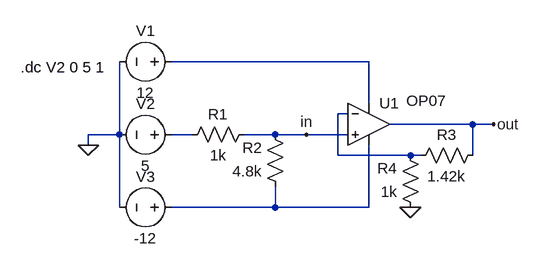
[diagram p0: schematic level_converter.asc]
level_converter.asc, the LTspice schematic file:
Version 4
SHEET 1 880 680
WIRE 224 -112 -80 -112
WIRE 224 -48 224 -112
WIRE 192 -32 176 -32
WIRE 384 -16 256 -16
WIRE 416 -16 384 -16
WIRE -160 0 -160 -112
WIRE -160 0 -208 0
WIRE -48 0 -80 0
WIRE 80 0 32 0
WIRE 128 0 80 0
WIRE 192 0 128 0
WIRE -208 16 -208 0
WIRE 176 32 176 -32
WIRE 288 32 176 32
WIRE 304 32 288 32
WIRE 384 32 384 -16
WIRE -160 112 -160 0
WIRE 80 112 80 80
WIRE 80 112 -80 112
WIRE 224 112 224 16
WIRE 224 112 80 112
FLAG -208 16 0
FLAG 416 -16 out
FLAG 128 0 in
FLAG 288 112 0
SYMBOL Opamps\\OP07 224 -80 R0
WINDOW 3 58 28 Left 2
SYMATTR InstName U1
SYMBOL voltage -64 -112 R90
WINDOW 0 -32 56 VBottom 2
WINDOW 3 32 56 VTop 2
WINDOW 123 0 0 Left 0
WINDOW 39 0 0 Left 0
SYMATTR InstName V1
SYMATTR Value 12
SYMBOL voltage -64 0 R90
WINDOW 0 -32 56 VBottom 2
WINDOW 3 32 56 VTop 2
WINDOW 123 0 0 Left 0
WINDOW 39 0 0 Left 0
SYMATTR InstName V2
SYMATTR Value 5
SYMBOL voltage -64 112 R90
WINDOW 0 -32 56 VBottom 2
WINDOW 3 32 56 VTop 2
WINDOW 123 0 0 Left 0
WINDOW 39 0 0 Left 0
SYMATTR InstName V3
SYMATTR Value -12
SYMBOL res 96 96 R180
WINDOW 0 36 76 Left 2
WINDOW 3 36 40 Left 2
SYMATTR InstName R2
SYMATTR Value 4.8k
SYMBOL res 400 16 R90
WINDOW 0 0 56 VBottom 2
WINDOW 3 32 56 VTop 2
SYMATTR InstName R3
SYMATTR Value 1.42k
SYMBOL res 304 128 R180
WINDOW 0 36 76 Left 2
WINDOW 3 36 40 Left 2
SYMATTR InstName R4
SYMATTR Value 1k
SYMBOL res 48 -16 R90
WINDOW 0 0 56 VBottom 2
WINDOW 3 32 56 VTop 2
SYMATTR InstName R1
SYMATTR Value 1k
TEXT -312 -104 Left 2 !.dc V2 0 5 1

The netlist it stands for:
* level_converter.asc
XU1 in N002 N001 N004 out LT1001  ; OP07, pins In+ In- V+ V- OUT
V1 N001 0 12
V2 N003 0 5
V3 N004 0 -12
R2 N004 in 4.8k
R3 out N002 1.42k
R4 0 N002 1k
R1 in N003 1k
.dc V2 0 5 1
.lib LTC.lib
.backanno
.end